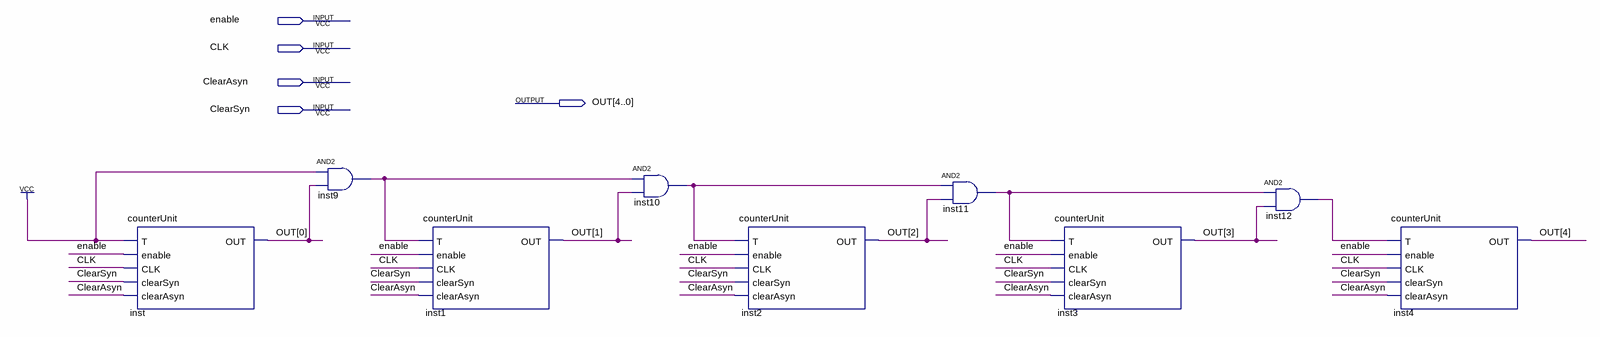
[diagram p0: schematic sheet]
// Quartus schematic counter5.bdf as structural Verilog: 9 symbols, 5 pins
module counter5 (
  input  enable,
  input  CLK,
  input  ClearAsyn,
  input  ClearSyn,
  output [4:0] OUT
);

  wire inst9_out, inst10_out, inst11_out, inst12_out;

  counterUnit inst (.T(1'b1), .enable(enable), .CLK(CLK), .clearSyn(ClearSyn), .clearAsyn(ClearAsyn), .OUT(OUT[0]));
  and inst9 (inst9_out, 1'b1, OUT[0]);
  counterUnit inst1 (
    .T(inst9_out), .enable(enable), .CLK(CLK), .clearSyn(ClearSyn), .clearAsyn(ClearAsyn), .OUT(OUT[1]));
  and inst10 (inst10_out, inst9_out, OUT[1]);
  counterUnit inst2 (
    .T(inst10_out), .enable(enable), .CLK(CLK), .clearSyn(ClearSyn), .clearAsyn(ClearAsyn), .OUT(OUT[2]));
  and inst11 (inst11_out, inst10_out, OUT[2]);
  counterUnit inst3 (
    .T(inst11_out), .enable(enable), .CLK(CLK), .clearSyn(ClearSyn), .clearAsyn(ClearAsyn), .OUT(OUT[3]));
  and inst12 (inst12_out, inst11_out, OUT[3]);
  counterUnit inst4 (
    .T(inst12_out), .enable(enable), .CLK(CLK), .clearSyn(ClearSyn), .clearAsyn(ClearAsyn), .OUT(OUT[4]));
endmodule
